# EAGLE design main (EAGLE 7.2.0)
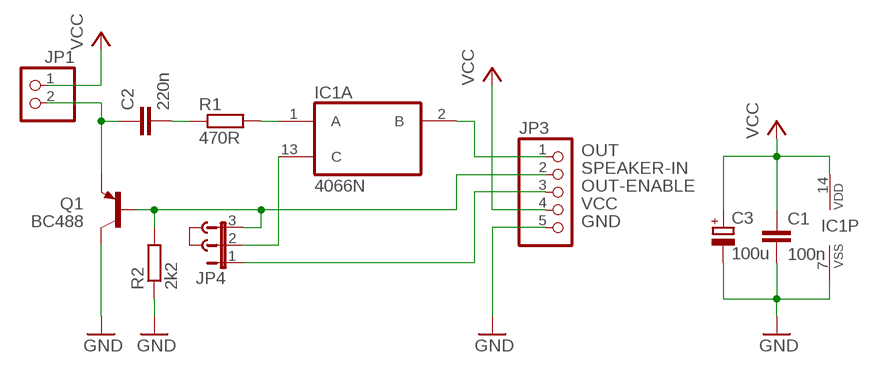
[diagram p0: schematic, sheet 1]

## Parts
C1  100n  C-EUC1206  [C1206]
C2  220n  C-EU025-025X050  [C025-025X050]
C3  100u  CPOL-EUE2-5  [E2-5]
IC1  4066N  [DIL14]
J1  JUMPER  [JUMP]
JP1  PINHD-1X2  [1X02]
JP3  PINHD-1X5  [1X05]
JP4  JP2E  [JP2]
Q1  BC488  [TO92-EBC]
R1  470R  R-EU_0204/7  [0204/7]
R2  2k2  R-EU_R1206  [R1206]

## Nets
GND: C1.2 C3.- IC1.7(P:VSS) JP3.5 Q1.C R2.1
N$3: C2.1 JP1.2 Q1.E
N$4: C2.2 R1.1
N$5: IC1.1(A:A) R1.2
N$8: IC1.13(A:C) JP4.2
OUT: IC1.2(A:B) JP3.1
OUT-ENABLE: JP3.3 JP4.1
SPEAKER-IN: JP3.2 JP4.3 Q1.B R2.2
VCC: C1.1 C3.+ IC1.14(P:VDD) JP1.1 JP3.4
Unconnected: IC1.3(B:B) IC1.4(B:A) IC1.5(B:C) IC1.6(C:C) IC1.8(C:A) IC1.9(C:B) IC1.10(D:B) IC1.11(D:A) IC1.12(D:C)

## Library data of the parts
C1 C2 = resistor:C-EU: CAPACITOR, European symbol
C3 = resistor:CPOL-EU: POLARIZED CAPACITOR, European symbol
IC1 = 40xx:4066: Quad bilateral ANALOG SWITCH
J1 = jumper:JUMPER: JUMPER header
JP1 = pinhead:PINHD-1X2: PIN HEADER
JP3 = pinhead:PINHD-1X5: PIN HEADER
JP4 = jumper:JP2E: JUMPER
Q1 = transistor-pnp:BC488*: PNP Transistror
R1 R2 = resistor:R-EU_: RESISTOR, European symbol

## Board
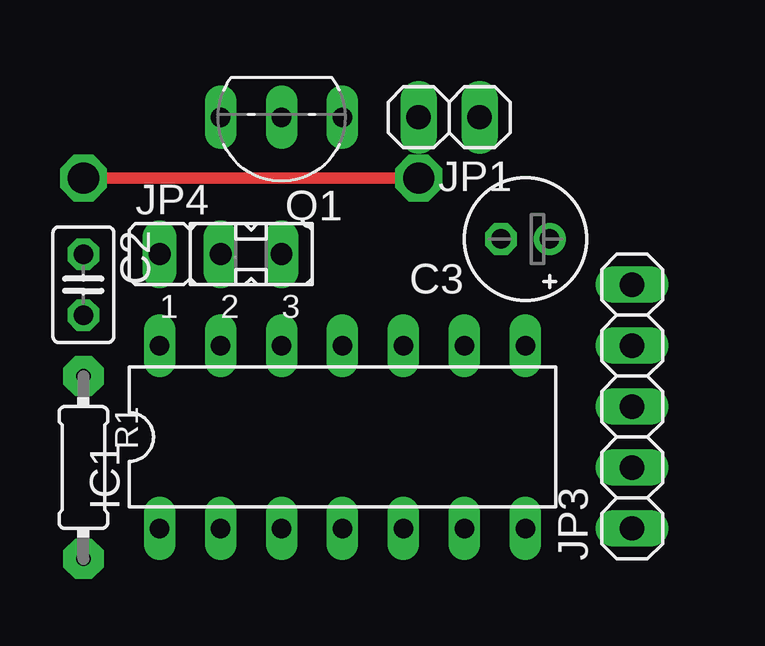
[diagram p1: board, top side]
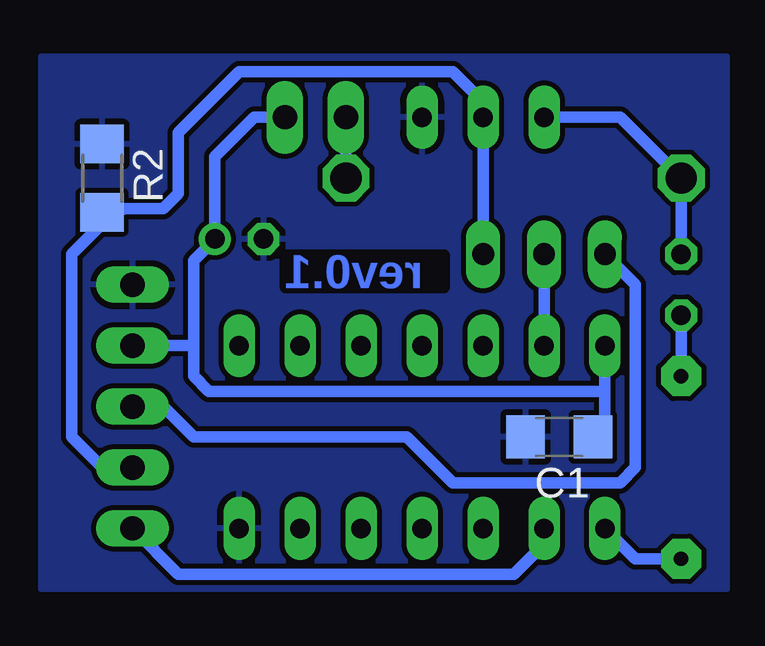
[diagram p2: board, bottom side, seen from below]

No outline drawn. Coordinates in mm, seen from the top.
Copper layers (1*16): Top 0.035mm / dielectric 1.5mm / Bottom 0.035mm
Design rules "default": minimum track width 10mil, minimum drill 24mil, track to track 8mil, track to pad 8mil, pad to pad 8mil, via to via 8mil, smd to smd 8mil, copper to edge 40mil, drill to drill 8mil, minimum pad ring 10mil, minimum via ring 8mil, stop-mask expansion 4mil, vias tented up to drill 0mil, thermal gap 10mil

### Footprints (pad centres in the part's own frame; a part is rotated, then mirrored left to right if it is on the bottom)
C1206 = smd 1.6 x 1.8: 1 -1.4,0; 2 1.4,0
C025-025X050 = drill 0.813 octagon: 1 -1.27,0; 2 1.27,0
E2-5 = drill 0.813 pad 1.27: + -1.016,0 | drill 0.813 pad 1.27 octagon: - 1.016,0
DIL14 = drill 0.813 long: 1 -7.62,-3.81; 2 -5.08,-3.81; 3 -2.54,-3.81; 4 0,-3.81; 5 2.54,-3.81; 6 5.08,-3.81; 7 7.62,-3.81; 8 7.62,3.81; 9 5.08,3.81; 10 2.54,3.81; 11 0,3.81; 12 -2.54,3.81; 13 -5.08,3.81; 14 -7.62,3.81
1X02 = drill 1.016 long: 1 -1.27,0; 2 1.27,0
1X05 = drill 1.016 long: 1 -5.08,0; 2 -2.54,0; 3 0,0; 4 2.54,0; 5 5.08,0
JP2 = drill 0.914 long: 1 -2.54,0; 2 0,0; 3 2.54,0
TO92-EBC = drill 0.813 long: B 0,-1.27; C -2.54,-1.27; E 2.54,-1.27
0204/7 = drill 0.6 pad 1.676 octagon: 1 -3.81,0; 2 3.81,0
R1206 = smd 1.6 x 1.803: 1 -1.422,0; 2 1.422,0

### Placement (x,y rotation side)
C1  6.99,6.35 180 bottom
C2  1.91,12.7 270 top
C3  20.32,14.61 180 top
IC1  12.7,6.35 0 top
J1  8.89,13.97 90 top
JP1  17.14,19.68 180 top
JP3  24.77,7.62 90 top
JP4  7.62,13.97 0 top
Q1  10.16,18.41 180 top
R1  1.91,5.08 270 top
R2  26.04,17.14 270 bottom

### Tracks (layer width: path | path; a pad name or v marks a point on that pad's centre or on a via)
GND
  pour Bottom: 0,22.23 0,0 28.57,0 28.57,22.23
N$3  (via drill 1.3)
  Top 0.483: v1.91,17.14 v15.88,17.14
  Bottom 0.483: C2.1 v1.91,17.14 4.45,19.68 Q1.E | v15.88,17.14 JP1.2
N$4
  Bottom 0.483: R1.1 C2.2
N$5
  Bottom 0.483: R1.2 3.81,1.27 IC1.1
N$8
  Bottom 0.483: IC1.13 JP4.2
OUT
  Bottom 0.483: IC1.2 7.62,1.91 8.89,0.64 22.86,0.64 JP3.1
OUT-ENABLE
  Bottom 0.483: JP4.1 3.81,12.7 3.81,5.08 4.45,4.45 11.43,4.45 13.34,6.35 22.23,6.35 23.5,7.62 JP3.3
SPEAKER-IN
  Bottom 0.483: JP3.2 26.04,5.08 27.3,6.35 27.3,13.97 25.4,15.88 24.92,15.88 | 24.92,15.88 R2.2 | 24.92,15.88 23.5,15.88 22.86,16.51 22.86,19.05 20.32,21.59 11.43,21.59 10.16,20.32 Q1.B JP4.3
VCC
  Bottom 0.483: JP3.4 22.23,10.16 | 22.23,10.16 22.23,13.72 C3.+ 21.34,18.03 19.68,19.68 JP1.1 | 5.08,8.26 5.08,6.86 C1.1 | IC1.14 5.08,8.26 | 5.08,8.26 21.59,8.26 22.23,8.89 22.23,10.16

### Text on the board
Bottom: rev0.1